# EAGLE design cryptostick-0v2 (EAGLE 6.6.0)

## Sheet 1 of 3: FTDI USB-Conn., FTDI-Chip
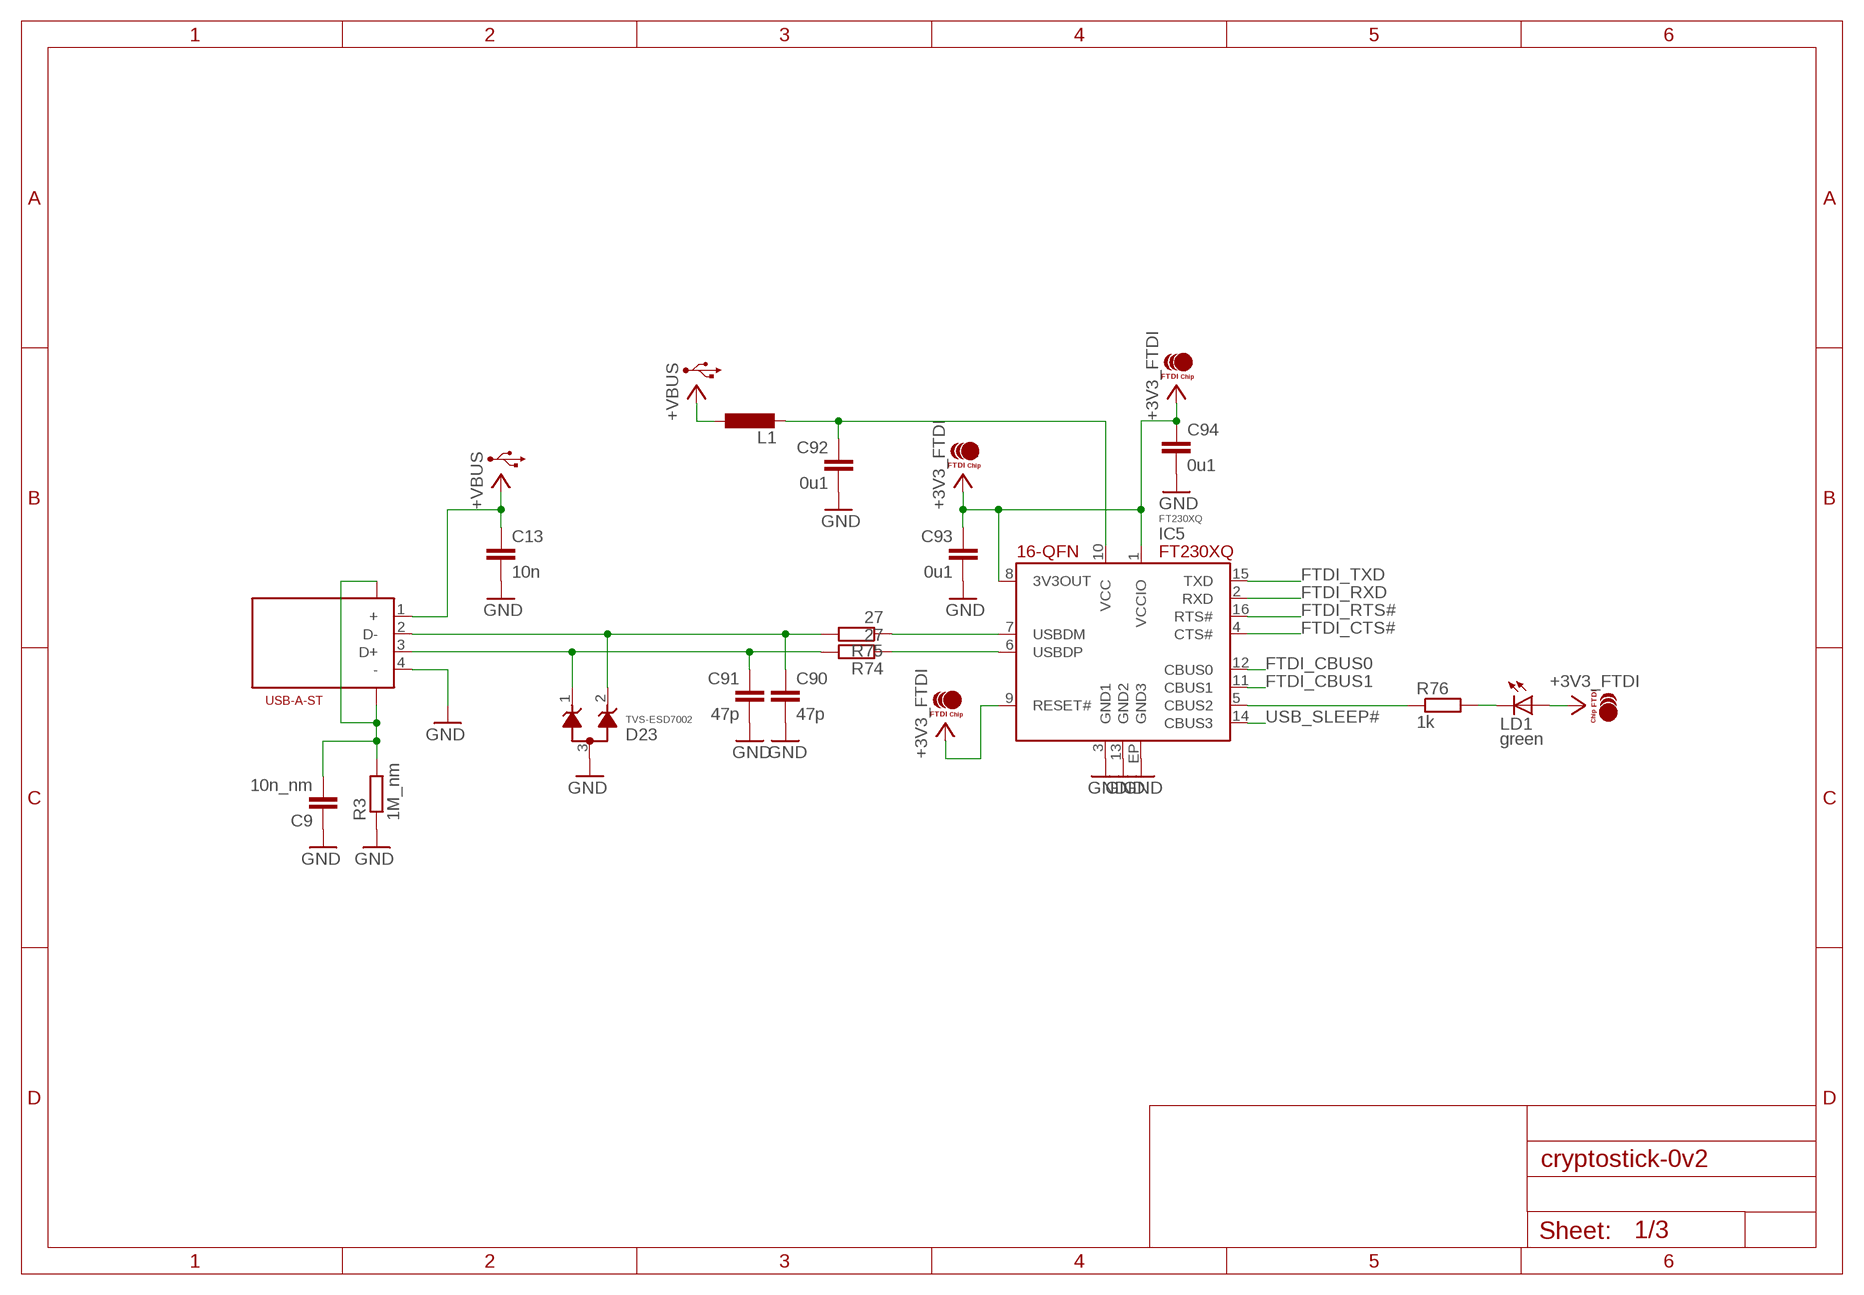
[diagram p0: schematic, sheet 1]

### Parts
C9  10n_nm  C-EUC0603  [C0603]
C13  10n  C-EUR0402-MCU  [R0402-MCU]
C90  47p  C-EUR0402-MCU  [R0402-MCU]
C91  47p  C-EUR0402-MCU  [R0402-MCU]
C92  0u1  C-EUR0402-MCU  [R0402-MCU]
C93  0u1  C-EUR0402-MCU  [R0402-MCU]
C94  0u1  C-EUR0402-MCU  [R0402-MCU]
D23  TVS-ESD7002  [SC70-3]
IC5  FT230XQ  [16QFN-FT230X]
J1  USB-A-ST  [USB-A-ST]
L1  L-EUR0402-MCU  [R0402-MCU]
LD1  green  LED-0603-SIDELED-RPI  [0603-SIDELED-RPI]
R3  1M_nm  R-EU_R0603  [R0603]
R74  27  R-EU_R0402-MCU  [R0402-MCU]
R75  27  R-EU_R0402-MCU  [R0402-MCU]
R76  1k  R-EU_R0402-MCU  [R0402-MCU]

### Nets
+3V3_FTDI: C93.1 C94.1 IC5.1(VCCIO) IC5.8(3V3OUT) IC5.9(RESET#) LD1.A ; also sheet 2,3
+5V_FTDI: C92.1 IC5.10(VCC) L1.2
+VBUS: C13.1 J1.1(+) L1.1 ; also sheet 2,3
FTDI_CBUS0: IC5.12(CBUS0) ; also sheet 2
FTDI_CBUS1: IC5.11(CBUS1) ; also sheet 2
FTDI_CTS#: IC5.4(CTS#) ; also sheet 2
FTDI_RTS#: IC5.16(RTS#) ; also sheet 2
FTDI_RXD: IC5.2(RXD) ; also sheet 2
FTDI_TXD: IC5.15(TXD) ; also sheet 2
FTDI_TXLED#: IC5.5(CBUS2) R76.1
GND: C9.1 C13.2 C90.2 C91.2 C92.2 C93.2 C94.2 D23.3 IC5.3(GND1) IC5.13(GND2) IC5.EP(GND3) J1.4(-) R3.1 ; also sheet 2,3
N$10: LD1.C R76.2
N$39: IC5.7(USBDM) R75.1
N$40: IC5.6(USBDP) R74.1
N$75: C91.1 D23.1 J1.3(D+) R74.2
N$76: C90.1 D23.2 J1.2(D-) R75.2
USB_SHLD: C9.2 J1.SH1 J1.SH2 R3.2
USB_SLEEP#: IC5.14(CBUS3) ; also sheet 2

## Sheet 2 of 3: MCU MSP430 Microcontroller, Crypto-IC
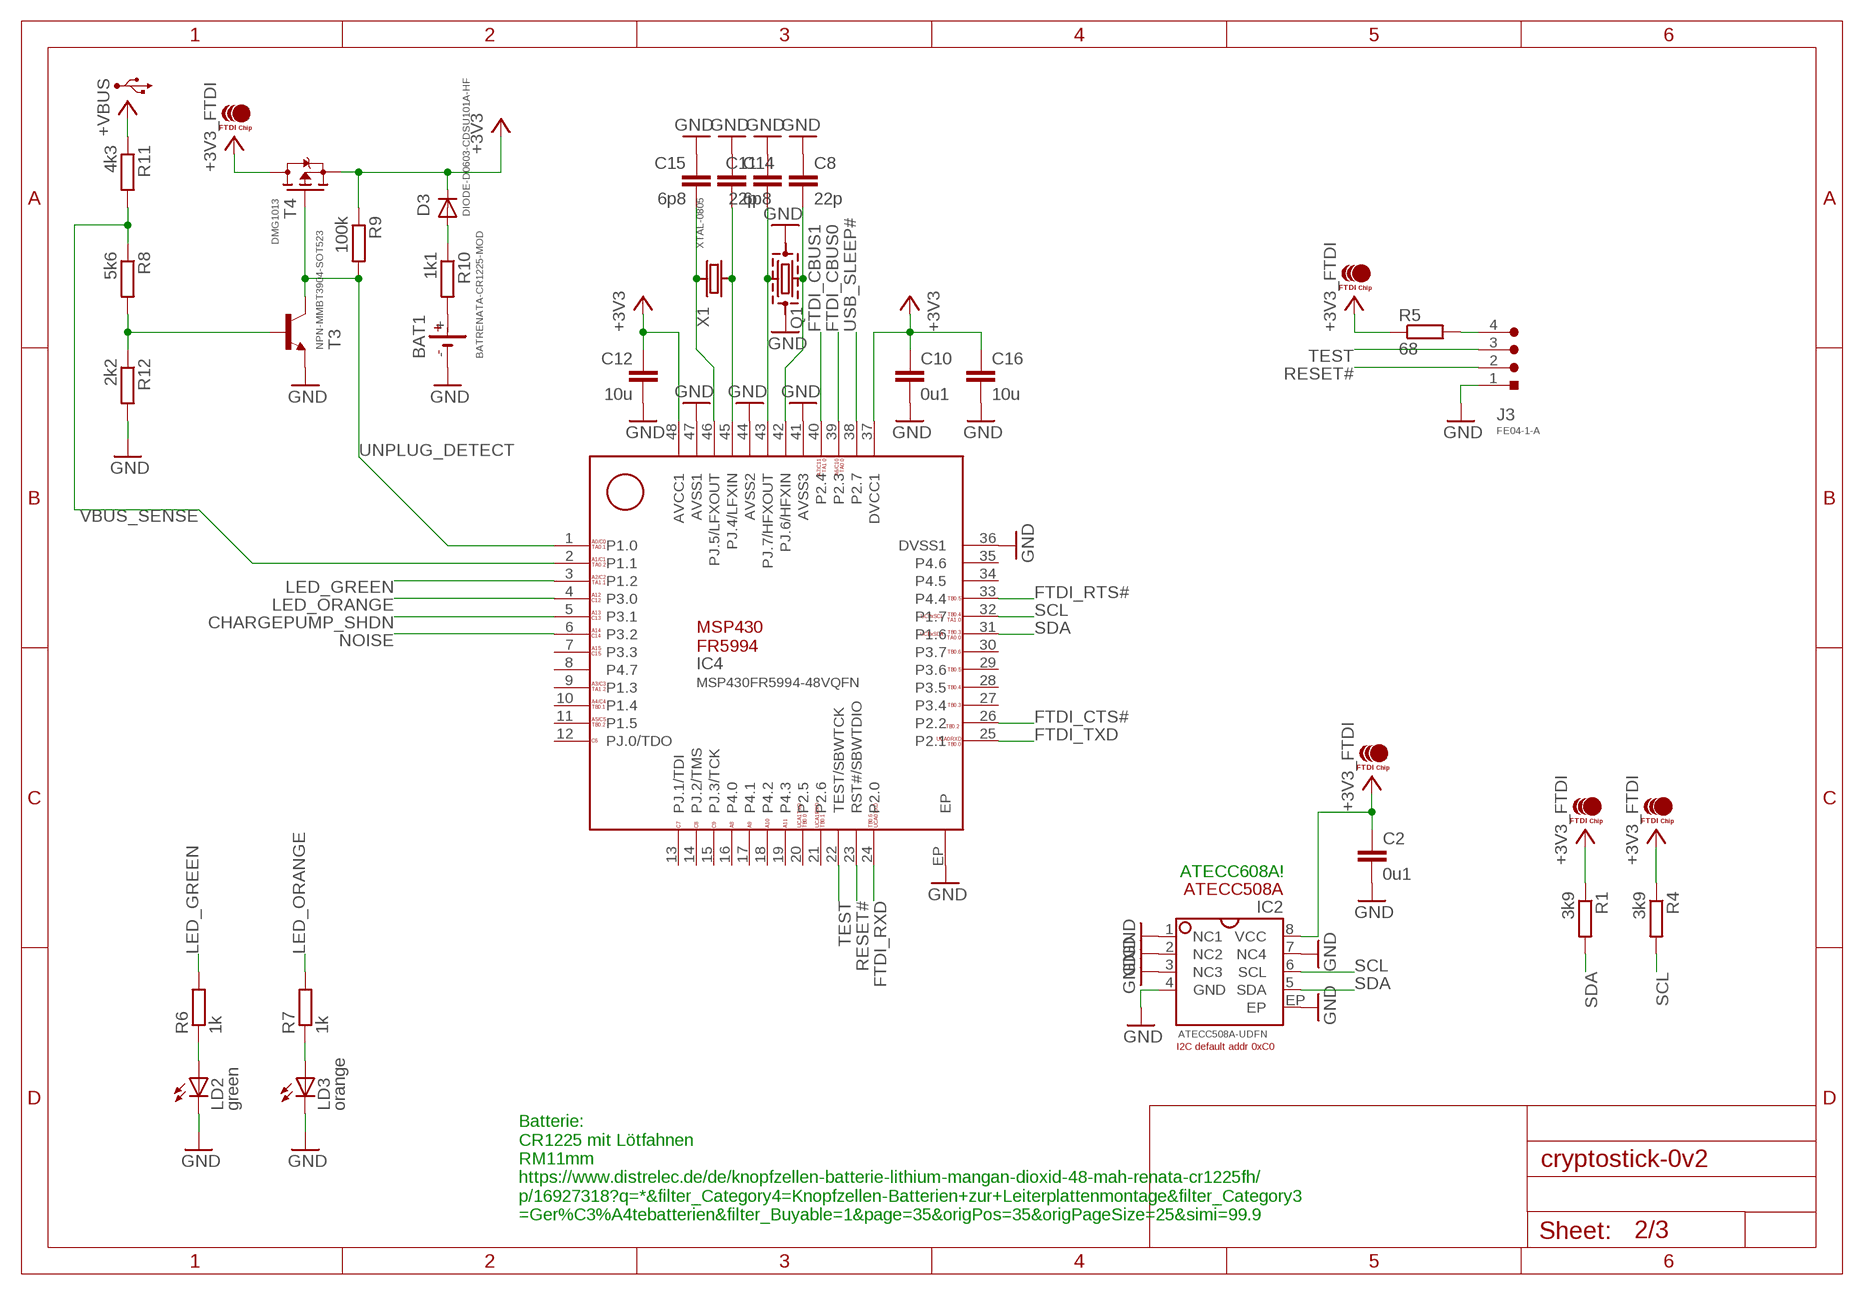
[diagram p1: schematic, sheet 2]

### Parts
BAT1  BATRENATA-CR1225-MOD  [BAT-RENATA-CR1225-MOD]
C2  0u1  C-EUR0402-MCU  [R0402-MCU]
C8  22p  C-EUR0402-MCU  [R0402-MCU]
C10  0u1  C-EUR0402-MCU  [R0402-MCU]
C11  22p  C-EUR0402-MCU  [R0402-MCU]
C12  10u  C-EUR0603-MCU  [R0603-MCU]
C14  6p8  C-EUR0402-MCU  [R0402-MCU]
C15  6p8  C-EUR0402-MCU  [R0402-MCU]
C16  10u  C-EUR0603-MCU  [R0603-MCU]
D3  DIODE-D0603-CDSU101A-HF  DIODE-D0603  [D-D0603]
IC2  ATECC508A-UDFN  [8UDFN]
IC4  MSP430FR5994-48VQFN  [48VQFN-MSP430FR5994]
J3  FE04-1-A  [FE04-1A]
LD2  green  LED-0603-SIDELED-RPI  [0603-SIDELED-RPI]
LD3  orange  LED-0603-SIDELED-RPI  [0603-SIDELED-RPI]
Q1  XTAL-2.0X1.6-MOD  [XTAL-2.0X1.6-MOD]
R1  3k9  R-EU_R0402-MCU  [R0402-MCU]
R4  3k9  R-EU_R0402-MCU  [R0402-MCU]
R5  68  R-EU_R0402-MCU  [R0402-MCU]
R6  1k  R-EU_R0402-MCU  [R0402-MCU]
R7  1k  R-EU_R0402-MCU  [R0402-MCU]
R8  5k6  R-EU_R0402-MCU  [R0402-MCU]
R9  100k  R-EU_R0402-MCU  [R0402-MCU]
R10  1k1  R-EU_R0402-MCU  [R0402-MCU]
R11  4k3  R-EU_R0402-MCU  [R0402-MCU]
R12  2k2  R-EU_R0402-MCU  [R0402-MCU]
T3  NPN-MMBT3904-SOT523  [SOT523]
T4  DMG1013  P-MOSFET-SC70-3  [SC70-3]
X1  XTAL-0805  [XTAL-32KHZ-0805]

### Nets
+3V3: C10.1 C12.1 C16.1 D3.C IC4.37(DVCC1) IC4.48(AVCC1) R9.1 T4.2(S)
+3V3_FTDI: C2.1 IC2.8(VCC) R1.1 R4.1 R5.1 T4.3(D) ; also sheet 1,3
+VBUS: R11.1 ; also sheet 1,3
CHARGEPUMP_SHDN: IC4.5(P3.1) ; also sheet 3
FTDI_CBUS0: IC4.39(P2.3) ; also sheet 1
FTDI_CBUS1: IC4.40(P2.4) ; also sheet 1
FTDI_CTS#: IC4.26(P2.2) ; also sheet 1
FTDI_RTS#: IC4.33(P4.4) ; also sheet 1
FTDI_RXD: IC4.24(P2.0) ; also sheet 1
FTDI_TXD: IC4.25(P2.1) ; also sheet 1
GND: BAT1.- C2.2 C8.1 C10.2 C11.1 C12.2 C14.1 C15.1 C16.2 IC2.1(NC1) IC2.2(NC2) IC2.3(NC3) IC2.4(GND) IC2.7(NC4) IC2.EP IC4.36(DVSS1) IC4.41(AVSS3) IC4.44(AVSS2) IC4.47(AVSS1) IC4.EP J3.1 LD2.C LD3.C Q1.2(GND1) Q1.4(GND2) R12.2 T3.2(E) ; also sheet 1,3
LED_GREEN: IC4.3(P1.2) R6.2
LED_ORANGE: IC4.4(P3.0) R7.2
N$1: J3.4 R5.2
N$3: LD3.A R7.1
N$4: LD2.A R6.1
N$11: C11.2 IC4.43(PJ.7/HFXOUT) Q1.1
N$13: C8.2 IC4.42(PJ.6/HFXIN) Q1.3
N$14: D3.A R10.1
N$16: C14.2 IC4.45(PJ.4/LFXIN) X1.P$1
N$17: BAT1.+ R10.2
N$18: R8.2 R12.1 T3.1(B)
N$19: C15.2 IC4.46(PJ.5/LFXOUT) X1.P$2
NOISE: IC4.6(P3.2) ; also sheet 3
RESET#: IC4.23(RST#/SBWTDIO) J3.2
SCL: IC2.6(SCL) IC4.32(P1.7) R4.2
SDA: IC2.5(SDA) IC4.31(P1.6) R1.2
TEST: IC4.22(TEST/SBWTCK) J3.3
UNPLUG_DETECT: IC4.1(P1.0) R9.2 T3.3(C) T4.1(G)
USB_SLEEP#: IC4.38(P2.7) ; also sheet 1
VBUS_SENSE: IC4.2(P1.1) R8.1 R11.2
Unconnected: IC4.7(P3.3) IC4.8(P4.7) IC4.9(P1.3) IC4.10(P1.4) IC4.11(P1.5) IC4.12(PJ.0/TDO) IC4.13(PJ.1/TDI) IC4.14(PJ.2/TMS) IC4.15(PJ.3/TCK) IC4.16(P4.0) IC4.17(P4.1) IC4.18(P4.2) IC4.19(P4.3) IC4.20(P2.5) IC4.21(P2.6) IC4.27(P3.4) IC4.28(P3.5) IC4.29(P3.6) IC4.30(P3.7) IC4.34(P4.5) IC4.35(P4.6)

### Notes on the sheet
- ATECC608A!
- Batterie:
  CR1225 mit Lötfahnen
  RM11mm
  https://www.distrelec.de/de/knopfzellen-batterie-lithium-mangan-dioxid-48-mah-renata-cr1225fh/
  p/16927318?q=*&filter_Category4=Knopfzellen-Batterien+zur+Leiterplattenmontage&filter_Category3
  =Ger%C3%A4tebatterien&filter_Buyable=1&page=35&origPos=35&origPageSize=25&simi=99.9

## Sheet 3 of 3: TRNG True Random Noise Generator: Noise Diode, Charge Pump
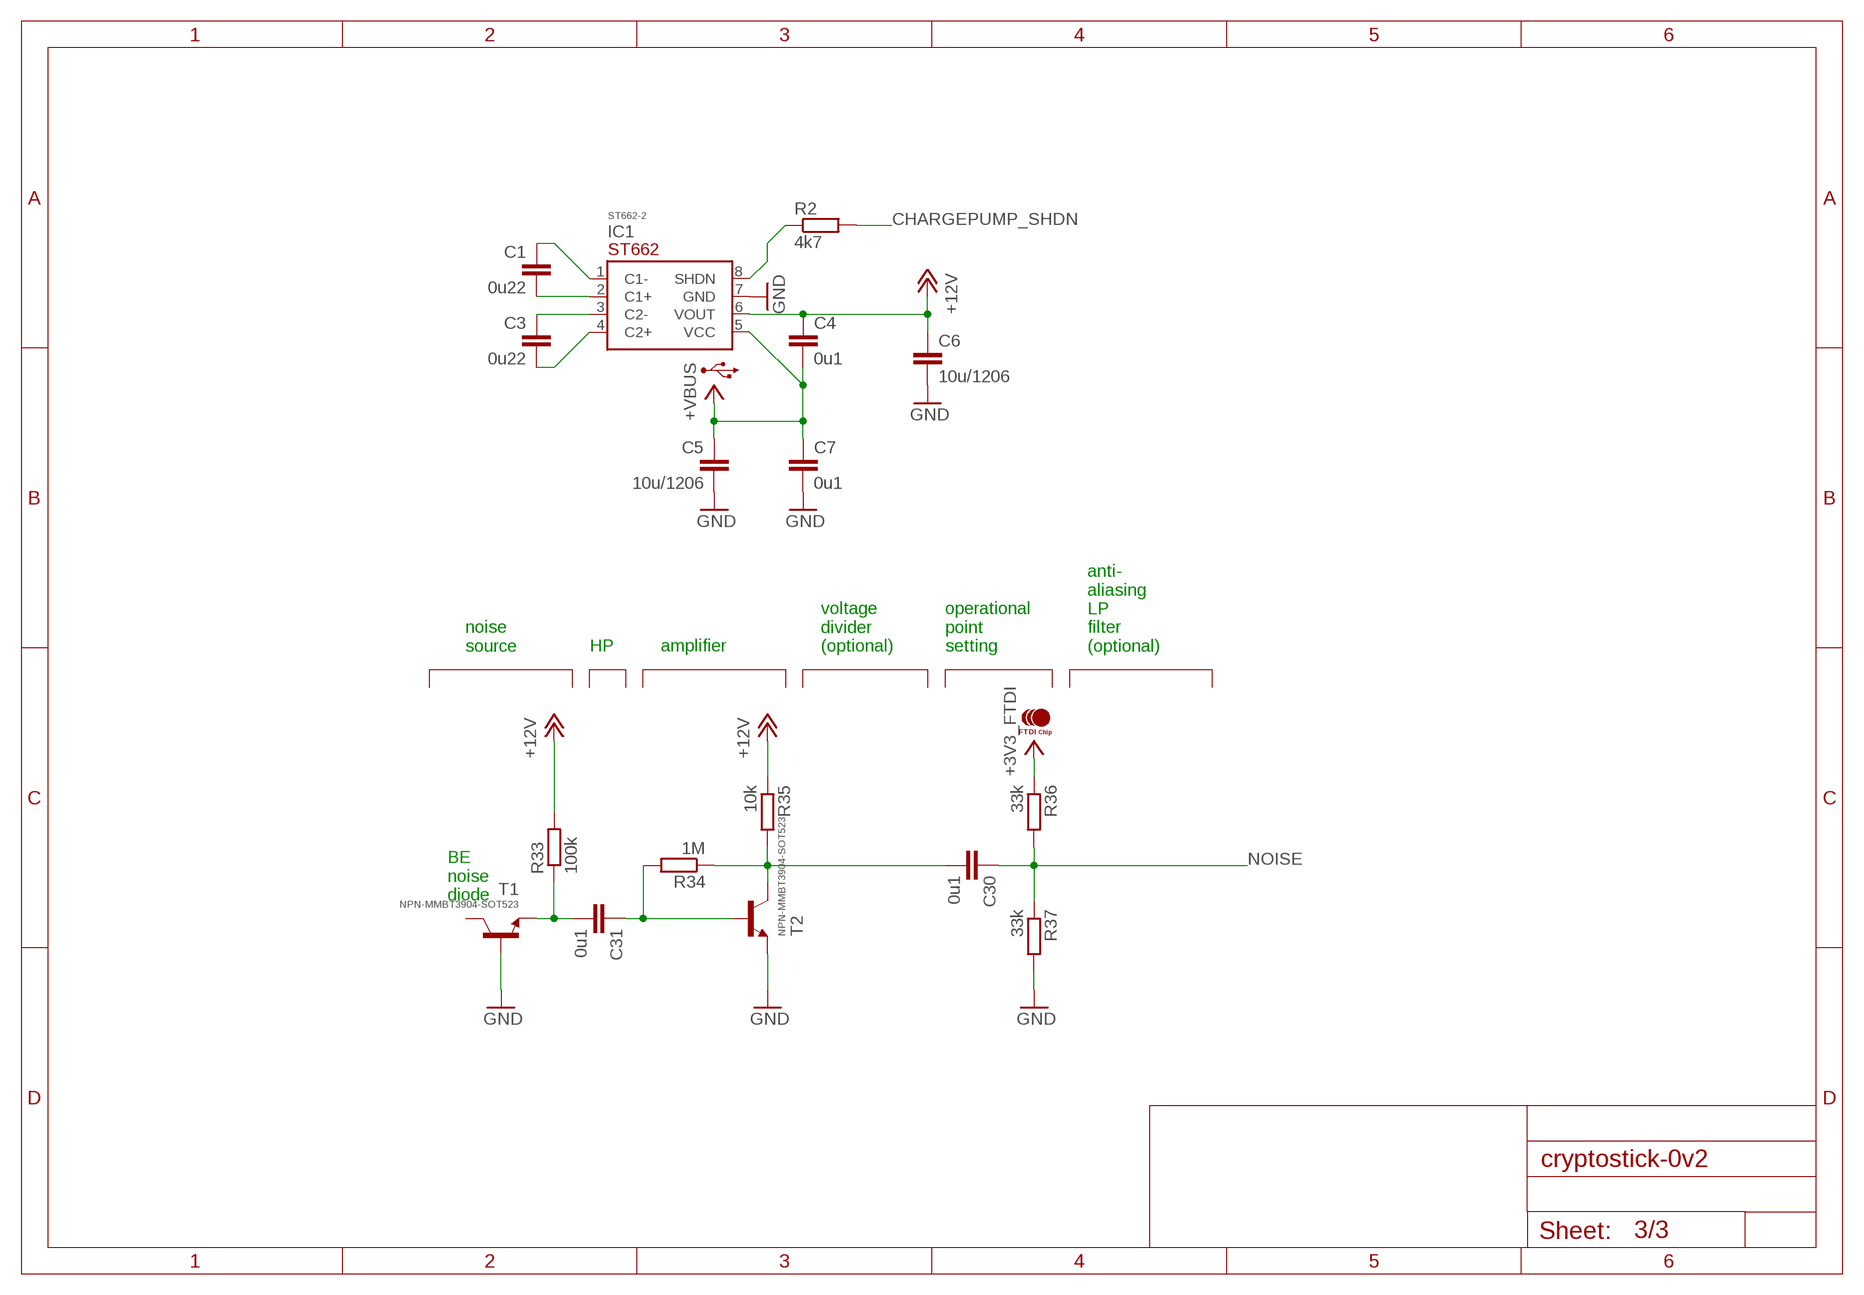
[diagram p2: schematic, sheet 3]

### Parts
C1  0u22  C-EUC0603  [C0603]
C3  0u22  C-EUC0603  [C0603]
C4  0u1  C-EUR0402-MCU  [R0402-MCU]
C5  10u/1206  C-EUC1206  [C1206]
C6  10u/1206  C-EUC1206  [C1206]
C7  0u1  C-EUR0402-MCU  [R0402-MCU]
C30  0u1  C-EUR0402-MCU  [R0402-MCU]
C31  0u1  C-EUR0402-MCU  [R0402-MCU]
IC1  ST662-2  [8SOIC-2]
R2  4k7  R-EU_R0402-MCU  [R0402-MCU]
R33  100k  R-EU_R0402-MCU  [R0402-MCU]
R34  1M  R-EU_R0402-MCU  [R0402-MCU]
R35  10k  R-EU_R0402-MCU  [R0402-MCU]
R36  33k  R-EU_R0402-MCU  [R0402-MCU]
R37  33k  R-EU_R0402-MCU  [R0402-MCU]
T1  NPN-MMBT3904-SOT523  [SOT523]
T2  NPN-MMBT3904-SOT523  [SOT523]

### Nets
+3V3_FTDI: R36.1 ; also sheet 1,2
+12V: C4.1 C6.1 IC1.6(VOUT) R33.2 R35.1
+VBUS: C4.2 C5.1 C7.1 IC1.5(VCC) ; also sheet 1,2
CHARGEPUMP_SHDN: R2.2 ; also sheet 2
GND: C5.2 C6.2 C7.2 IC1.7(GND) R37.2 T1.1(B) T2.2(E) ; also sheet 1,2
N$2: C31.1 R34.2 T2.1(B)
N$5: C30.2 R34.1 R35.2 T2.3(C)
N$6: C3.1 IC1.3(C2-)
N$7: C1.2 IC1.2(C1+)
N$8: C1.1 IC1.1(C1-)
N$9: C3.2 IC1.4(C2+)
N$12: IC1.8(SHDN) R2.1
N$35: C31.2 R33.1 T1.2(E)
NOISE: C30.1 R36.2 R37.1 ; also sheet 2
Unconnected: T1.3(C)

### Notes on the sheet
- noise
  source
- HP | amplifier
- voltage
  divider
  (optional)
- operational
  point
  setting
- anti-
  aliasing
  LP
  filter
  (optional)
- BE
  noise
  diode

## Library data of the parts
BAT1 = cryptostick:BAT
C1-C16 C30 C31 C90-C94 = rcl:C-EU: CAPACITOR, European symbol
D3 = bdsm:DIODE
D23 = hg-box:TVS-ESD7002
IC1 = cryptostick:ST662
IC2 = hg-box:ATECC508A-UDFN
IC4 = cryptostick:MSP430FR5994-48VQFN
IC5 = bdsm:FT230XQ
J1 = cocs:USB-A-ST
J3 = cryptostick:FE04-1
L1 = rcl:L-EU: INDUCTOR, European symbol
LD1-LD3 = led:LED: LED OSRAM: - CHIPLED LG R971, LG N971, LY N971, LG Q971, LY Q971, LO R971, LY R971 LH N974, LH R974 LS Q976, LO Q976, LY Q976 LO Q996 - Hyper CHIPLED LW Q18S LB Q993, LB Q99A, LB R99A - SideLED LS A670, LO A670, LY A670, LG A670, LP A670 LB A673, LV A673, LT A673, LW A673 LH A674 LY A675 LS A676, LA A676, LO A676, LY A676, LW A676 LS A679, LY A679, LG A679 - Hyper Micro SIDELED® LS Y876, LA Y876, LO Y876, LY Y876 LT Y87S - SmartLED LW L88C, LW L88S LB L89C, LB L89S, LG L890 LS L89K, LO L89K, LY L89K LS L896, LA L896, LO L896, LY L896 - TOPLED LS T670, LO T670, LY T670, LG T670, LP T670 LSG T670, LSP T670, LSY T670, LOP T670, LYG T670 LG T671, LOG T671, LSG T671 LB T673, LV T673, LT T673, LW T673 LH T674 LS T676, LA T676, LO T676, LY T676, LB T676, LH T676, LSB T676, LW T676 LB T67C, LV T67C, LT T67C, LS T67K, LO T67K, LY T67K, LW E67C LS E67B, LA E67B, LO E67B, LY E67B, LB E67C, LV E67C, LT E67C LW T67C LS T679, LY T679, LG T679 LS T770, LO T770, LY T770, LG T770, LP T770 LB T773, LV T773, LT T773, LW T773 LH T774 LS E675, LA E675, LY E675, LS T675 LS T776, LA T776, LO T776, LY T776, LB T776 LHGB T686 LT T68C, LB T68C - Hyper Mini TOPLED® LB M676 - Mini TOPLED Santana® LG M470 LS M47K, LO M47K, LY M47K Source: http://www.osram.convergy.de LUXEON: - LUMILED® LXK2-PW12-R00, LXK2-PW12-S00, LXK2-PW14-U00, LXK2-PW14-V00 LXK2-PM12-R00, LXK2-PM12-S00, LXK2-PM14-U00 LXK2-PE12-Q00, LXK2-PE12-R00, LXK2-PE12-S00, LXK2-PE14-T00, LXK2-PE14-U00 LXK2-PB12-K00, LXK2-PB12-L00, LXK2-PB12-M00, LXK2-PB14-N00, LXK2-PB14-P00, LXK2-PB14-Q00 LXK2-PR12-L00, LXK2-PR12-M00, LXK2-PR14-Q00, LXK2-PR14-R00 LXK2-PD12-Q00, LXK2-PD12-R00, LXK2-PD12-S00 LXK2-PH12-R00, LXK2-PH12-S00 LXK2-PL12-P00, LXK2-PL12-Q00, LXK2-PL12-R00 Source: www.luxeon.com KINGBRIGHT: KA-3528ASYC Source: www.kingbright.com
Q1 = cocs:XTAL
R1-R12 R33-R37 R74-R76 = rcl:R-EU_: RESISTOR, European symbol
T1-T3 = bdsm:NPN-MMBT3904
T4 = bdsm:P-MOSFET
X1 = cocs:XTAL-0805

## Board
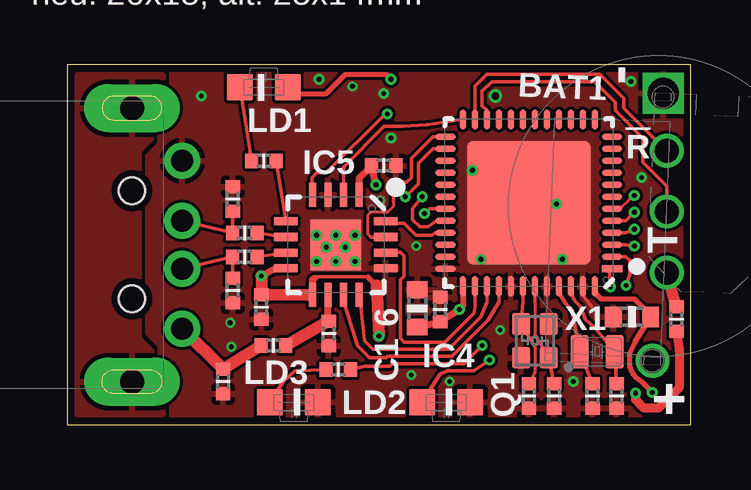
[diagram p3: board, top side]
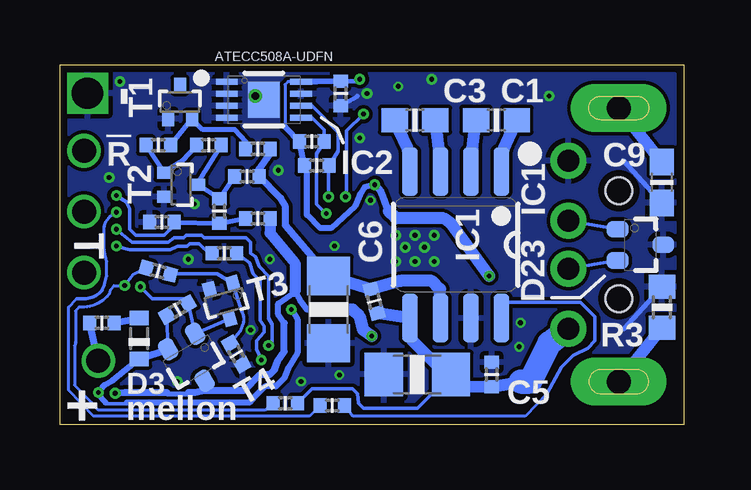
[diagram p4: board, bottom side, seen from below]

Size 26 x 15 mm. Coordinates in mm from the lower left corner, seen from the top.
Outline: 0,0 26,0 26,15 0,15 0,0
Copper layers (1*16): Top 0.035mm / dielectric 1.5mm / Bottom 0.035mm
Design rules "PCB-POOL HighSpec *": minimum track width 0.125mm, minimum drill 0.2mm, track to track 0.125mm, track to pad 0.125mm, pad to pad 0.125mm, via to via 0.125mm, smd to smd 0.125mm, copper to edge 0.3mm, drill to drill 0.2mm, minimum pad ring 0.2mm, minimum via ring 0.1mm, stop-mask expansion 0.075mm, vias tented up to drill 0mil, thermal gap 0.2mm

### Footprints (pad centres in the part's own frame; a part is rotated, then mirrored left to right if it is on the bottom)
BAT-RENATA-CR1225-MOD = drill 1 pad 1.4: + 11.15,0 | drill 1.3 pad 1.7: - 0,0
C0603 = smd 1.1 x 1: 1 -0.85,0; 2 0.85,0
R0402-MCU = smd 0.54 x 0.6: 1 -0.51,0; 2 0.51,0
C1206 = smd 1.6 x 1.8: 1 -1.4,0; 2 1.4,0
R0603-MCU = smd 0.7 x 0.85: 1 -0.775,0; 2 0.775,0
D-D0603 = smd 0.6 x 0.8: A -0.85,0; C 0.85,0
SC70-3 = smd 0.7 x 0.9: 1 -0.65,-0.95; 2 0.65,-0.95; 3 0,0.95
8SOIC-2 = smd 0.66 x 2: 1 -1.905,-3.05; 2 -0.635,-3.05; 3 0.635,-3.05; 4 1.905,-3.05; 5 1.905,3.05; 6 0.635,3.05; 7 -0.635,3.05; 8 -1.905,3.05
8UDFN = smd 0.9 x 0.25: 1 -1.55,0.75; 2 -1.55,0.25; 3 -1.55,-0.25; 4 -1.55,-0.75; 5 1.55,-0.75; 6 1.55,-0.25; 7 1.55,0.25; 8 1.55,0.75 | smd 1.3 x 1.5: EP 0,0
48VQFN-MSP430FR5994 = smd 0.85 x 0.28: 1 -3.475,2.75; 2 -3.475,2.25; 3 -3.475,1.75; 4 -3.475,1.25; 5 -3.475,0.75; 6 -3.475,0.25; 7 -3.475,-0.25; 8 -3.475,-0.75; 9 -3.475,-1.25; 10 -3.475,-1.75; 11 -3.475,-2.25; 12 -3.475,-2.75; 25 3.475,-2.75; 26 3.475,-2.25; 27 3.475,-1.75; 28 3.475,-1.25; 29 3.475,-0.75; 30 3.475,-0.25; 31 3.475,0.25; 32 3.475,0.75; 33 3.475,1.25; 34 3.475,1.75; 35 3.475,2.25; 36 3.475,2.75 | smd 0.28 x 0.85: 13 -2.75,-3.475; 14 -2.25,-3.475; 15 -1.75,-3.475; 16 -1.25,-3.475; 17 -0.75,-3.475; 18 -0.25,-3.475; 19 0.25,-3.475; 20 0.75,-3.475; 21 1.25,-3.475; 22 1.75,-3.475; 23 2.25,-3.475; 24 2.75,-3.475; 37 2.75,3.475; 38 2.25,3.475; 39 1.75,3.475; 40 1.25,3.475; 41 0.75,3.475; 42 0.25,3.475; 43 -0.25,3.475; 44 -0.75,3.475; 45 -1.25,3.475; 46 -1.75,3.475; 47 -2.25,3.475; 48 -2.75,3.475 | smd 5.15 x 5.15: EP 0,0
16QFN-FT230X = smd 1 x 0.325: 1 -2.08,0.975; 2 -2.08,0.325; 3 -2.08,-0.325; 4 -2.08,-0.975; 9 2.08,-0.975; 10 2.08,-0.325; 11 2.08,0.325; 12 2.08,0.975 | smd 0.325 x 1: 5 -0.975,-2.08; 6 -0.325,-2.08; 7 0.325,-2.08; 8 0.975,-2.08; 13 0.975,2.08; 14 0.325,2.08; 15 -0.325,2.08; 16 -0.975,2.08 | smd 2.1 x 2.1: EP 0,0
USB-A-ST = drill 0.92 pad 1.5: 1 3.5,4.8; 2 1,4.8; 3 -1,4.8; 4 -3.5,4.8 | drill 1 pad 2 long: SH1 5.7,2.7; SH2 -5.7,2.7 | hole 1.1: -2.25,2.7; 2.25,2.7
FE04-1A = drill 1.3 pad 1.7 square: 1 -3.66,-0.15 | drill 1 pad 1.4: 2 -1.27,0; 3 1.27,0; 4 3.81,0
0603-SIDELED-RPI = smd 1.1 x 1.1: A -1,0.235; C 1,0.235
XTAL-2.0X1.6-MOD = smd 0.9 x 0.75: 1 -0.7,-0.575; 2 0.7,-0.575; 3 0.7,0.575; 4 -0.7,0.575
R0603 = smd 1 x 1.1: 1 -0.85,0; 2 0.85,0
SOT523 = smd 0.5 x 0.61: 1 -0.5,-0.7; 2 0.5,-0.7; 3 0,0.7
XTAL-32KHZ-0805 = smd 0.75 x 1.4: P$1 -0.725,0; P$2 0.725,0

### Placement (x,y rotation side)
BAT1  24.85,13.81 267.7 top
C1  7.8,12.7 180 bottom
C2  14.3,13.8 270 bottom
C3  11.2,12.7 180 bottom
C4  12.9,5.15 285 bottom
C5  11.1,2.1 180 bottom
C6  14.8,4.8 270 bottom
C7  8,2.1 90 bottom
C8  19.25,1.2 90 top
C9  0.9,10.1 90 bottom
C10  15.55,4.8 90 top
C11  20.3,1.2 90 top
C12  23.55,4.5 180 top
C13  6.5,1.8 270 top
C14  21.9,1.2 90 top
C15  22.9,1.2 90 top
C16  14.6,4.85 90 top
C30  19.35,8.9 90 bottom
C31  21.9,11.65 0 bottom
C90  6.9,5.6 270 top
C91  6.9,9.4 90 top
C92  10.9,3.8 270 top
C93  8.1,4.9 270 top
C94  13.2,10.8 0 top
D3  22.7,3.6 270 bottom
D23  1.8,7.5 270 bottom
IC1  9.5,7.5 180 bottom
IC2  17.5,13.55 0 bottom
IC4  19.25,9.25 180 top
IC5  11.2,7.5 270 top
J1  0,7.5 270 top
J3  25,10.15 270 top
L1  8.6,3.3 0 top
LD1  8.2,14.3 180 top
LD2  15.8,0.7 0 top
LD3  9.45,0.7 0 top
Q1  19.5,3.5 90 top
R1  15.5,11.8 0 bottom
R2  14.65,0.8 180 bottom
R3  0.9,4.9 270 bottom
R4  15.3,10.8 0 bottom
R5  25.4,4.4 90 top
R6  19.15,7.15 180 bottom
R7  11.3,2.3 0 top
R8  21.9,6.4 345 bottom
R9  21.1,4.8 30 bottom
R10  24.25,4.25 180 bottom
R11  16.6,0.9 180 bottom
R12  18.65,2.95 300 bottom
R33  17.75,11.5 0 bottom
R34  19.8,11.65 180 bottom
R35  18.2,10.35 180 bottom
R36  17.75,8.6 180 bottom
R37  21.75,8.45 180 bottom
R74  7.4,8 180 top
R75  7.4,7 180 top
R76  8.2,11 180 top
T1  21,13.45 0 bottom
T2  20.95,10 270 bottom
T3  19.1,5.1 195 bottom
T4  20.45,2.65 210 bottom
X1  22.1,3.05 0 top

### Tracks (layer width: path | path; a pad name or v marks a point on that pad's centre or on a via)
+3V3  (via drill 0.2 pad 0.45)
  Top 0.2: 22,5.5 22.25,5.25 23.65,5.25 24.15,4.75 C12.1 | v24.4,1.35 23.95,1.8 arc-60 23.45,2.6 23.45,3 23.7,3.5
  Top 0.25: IC4.37 16.5,4.95 v16.35,4.8 | IC4.48 22,5.5 | 23.7,3.5 C12.1
  Top 0.3: C16.1 C10.1 v16.35,4.8
  Bottom 0.15: 23.2,0.93 23.2,0.88 24.05,0.88 24.1,0.93 | R9.1 T4.2
  Bottom 0.25: v16.35,4.8 16.1,4.4 16.1,3 16.5,2.35 16.65,1.95 17,1.6 17.45,1.6 17.9,1.15 18.1,0.93 23.2,0.93 | 24.1,0.93 24.4,1.25 v24.4,1.35 24.15,1.65 23.8,1.85 D3.C
  Bottom 0.3: D3.C T4.2
+3V3_FTDI  (via drill 0.2 pad 0.45)
  Top 0.15: 10.3,6.1 10.38,6.17 12.53,6.17 12.55,6.15
  Top 0.2: LD1.A 9.5,13.8 10.8,13.8 11.6,14.6 13.3,14.6 v13.5,14.4 | 12.55,6.15 12.9,5.8
  Top 0.3: IC5.8 8.71,6.53 v8.1,6.2 | 10.1,5.4 IC5.9 10.22,6.03 10.3,6.1 | IC5.1 12.18,10.28 12.6,10.7 C94.1 v12.88,10
  Top 0.375: R5.1 25.51,3.1 25.51,1.55 24.65,0.7 24.05,0.7 23.7,1.05 v23.7,1.31
  Top 0.5: v8.1,6.2 C93.1 10.1,5.4 | 12.9,5.8 v13,3.7
  Bottom 0.125: IC2.8 16.5,14.3 16.62,14.18 16.62,12.43 16.6,12.4
  Bottom 0.2: v13.5,14.4 13.6,14.3 C2.1 | 21.55,1.35 21.55,1.3 20.65,1.3 20.65,1.35
  Bottom 0.25: C2.1 15.3,14.3 IC2.8 | v12.88,10 13.3,9.9 13.5,9.6 13.7,9.1 14.7,8.2 15.15,8.2 15.7,8.75 15.7,10.6 R4.1 R1.1 16.6,12.4 | 15.45,4.8 15.7,4.8 16,5.2 16.2,5.55 16.9,5.05 16.9,4.6 16.65,4.25
  Bottom 0.3: 12.3,8.9 12.6,9.7 v12.88,10 | v23.7,1.31 23.3,1.35 21.55,1.35 | 20.65,1.35 20.35,1.35 20,1.45 | 20,1.45 18.3,1.45 17.65,2.1 17.25,2.1 17.05,2.3 16.9,2.7 16.65,3.05 16.65,4.25 | T4.3 20,1.45
  Bottom 0.45: R36.1 17.25,8.45 17.25,8 16.2,6.75 16.2,5.55
  Bottom 0.5: v8.1,6.2 9.7,8.4 10,8.6 12,8.6 12.3,8.9 | v13,3.7 13.35,3.95 13.5,4.5 13.8,4.8 15.45,4.8
+5V_FTDI
  Top 0.3: C92.1 10.88,4.6 IC5.10
  Top 0.5: L1.2 C92.1
+12V
  Bottom 0.3: C6.1 16.6,8.3 16.6,9.1 16.8,9.45 R35.1 17.7,10.5 17.7,10.65 17.25,11.3 17.25,11.35 R33.2
  Bottom 0.5: IC1.6 10.15,5.65 10.5,6 11.8,6 C4.1 C6.1
+VBUS
  Top 0.5: J1.1 C13.1 L1.1
  Bottom 0.15: C5.1 11.1,0.7 13.35,0.7 13.55,0.9 13.6,1.3 13.8,1.5 15.5,1.5 R11.1
  Bottom 0.5: C4.2 IC1.5 11.3,3.5 10.4,2.6 C5.1 9.5,1.6 C7.1 6.8,1.8
  Bottom 1: 6.8,1.8 6.4,1.8 5.6,3.4 J1.1
CHARGEPUMP_SHDN  (via drill 0.2 pad 0.45)
  Top 0.15: v23.65,8.85 23.3,8.5 IC4.5
  Bottom 0.125: R2.2 15.6,0.36 24.6,0.36 25.64,1.45 25.64,4.9 25.3,5.25 | 24.25,5.6 24.15,5.8 24.05,6.2 24.05,6.8 24.15,7.3 24.15,8.25 24.1,8.45 23.9,8.7 v23.65,8.85
  Bottom 0.15: 25.3,5.25 25,5.25 arc-50 24.25,5.6
FTDI_CBUS0
  Top 0.15: IC5.12 12.25,4.85 12.4,3.5 12.75,3.15 15.9,3.15 17.25,4.5 17.5,5.1 IC4.39
FTDI_CBUS1
  Top 0.15: IC5.11 11.6,4.9 12.1,3.3 12.6,2.8 13.3,2.8 13.35,2.85 16.05,2.85 17.55,4.35 18,5.1 IC4.40
FTDI_CTS#  (via drill 0.2 pad 0.45)
  Top 0.15: IC5.4 10.2,10.3 10.4,10.5 10.8,10.5 13.25,12.95 v13.35,12.95 | v14.1,9.5 14.65,10.05 14.65,10.9 15.25,11.5 IC4.26
  Bottom 0.15: v13.35,12.95 14.05,12.25 14.05,9.8 v14.1,9.5
FTDI_RTS#
  Top 0.15: IC5.16 13.5,8.4 14.05,8.4 14.55,7.9 15.2,7.9 15.35,8 IC4.33
FTDI_RXD
  Top 0.15: IC5.2 11.53,10.72 13.2,12.45 14,12.45 15,12.5 IC4.24
FTDI_TXD
  Top 0.125: 13.6,9.3 13.6,9.1 13.35,8.85 12.65,8.85 12.53,8.72 12.53,7.97 12.68,7.83
  Top 0.15: 13.6,9.3 13.6,9.75 13.95,10.1 14.15,10.1 14.35,10.3 14.35,11.1 15.25,12 IC4.25 | 12.68,7.83 IC5.15
FTDI_TXLED#
  Top 0.15: R76.1 IC5.5
GND  (via drill 0.2 pad 0.4, 0.2 pad 0.45, 0.3 pad 0.55)
  Top 0.15: IC4.47 21.5,5.4 21.85,4.95
  Bottom 0.2: R3.1 2.5,4 | C9.1 2.5,11 | C2.2 13.6,13.7
  other vias: 23.5,14.3 5.6,13.7 10.5,14.4 16.9,10.6 13.5,11.95 17.85,13.7 11.2,6.8 13.05,9.35 13.2,13.8 11.9,14.1 21.1,1.8 23.95,10.3 6.85,3.25 17.25,6.9 14.55,7.45 15.95,1.8 14.35,2.08 18.05,3.95 6.8,4.25 20.65,6.9 10.4,7.9 10.4,6.8 12,6.8 12,7.9 20.4,9.2 11.2,7.9 10.8,7.4 11.6,7.4
  pour Top (isolate 0.125, rank 2): 25.62,14.62 25.62,0.38 0.38,0.38 0.38,14.62
  pour Bottom (isolate 0.15): 25.62,14.62 25.62,0.38 0.38,0.38 0.38,14.62
LED_GREEN  (via drill 0.2 pad 0.45)
  Top 0.15: v23.65,7.45 23.3,7.5 IC4.3
  Bottom 0.15: R6.2 19.75,7.1 20.2,7.55 20.6,7.55 20.7,7.45 21.1,7.45 21.4,7.3 23.1,7.3 v23.65,7.45
LED_ORANGE  (via drill 0.2 pad 0.45)
  Top 0.15: R7.2 12.4,2.45 13.45,2.45 13.55,2.55 16.55,2.55 v17.3,3.3 | IC4.4 23.3,8 v23.65,8.15
  Bottom 0.15: v17.3,3.3 17.15,3.35 17.15,4.2 17.3,4.45 17.3,6.2 17.7,6.6 17.85,7 18.05,7.15 18.05,7.6 18.25,7.8 20,7.8 20.1,7.9 20.75,7.9 20.85,7.8 21.25,7.8 21.5,7.6 23,7.6 23.4,7.95 v23.65,8.15
N$1
  Top 0.45: R5.2 J3.4
N$2
  Bottom 0.2: C31.1 T2.1 21.5,10.65 20.9,11 R34.2
N$3
  Top 0.15: LD3.A 9,1.8 9.5,2.25 R7.1
N$4  (via drill 0.2 pad 0.45)
  Top 0.15: LD2.A 15.55,2.1 15.85,2.25 16.95,2.25 v17.6,2.7
  Bottom 0.15: v17.6,2.7 17.8,3.15 17.8,3.5 17.5,3.85 17.5,4.1 17.65,4.35 17.65,6 17.95,6.3 18.1,6.75 R6.1
N$5
  Bottom 0.2: R34.1 19.96,10.54 20.2,10.15 T2.3 C30.2 R35.2
N$6
  Bottom 0.5: IC1.3 10.2,11.5 C3.1
N$7
  Bottom 0.5: IC1.2 8.8,11.5 C1.2
N$8
  Bottom 0.5: IC1.1 7.5,11.5 C1.1
N$9
  Bottom 0.5: IC1.4 11.5,11.5 C3.2
N$10
  Top 0.15: LD1.C R76.2
N$11
  Top 0.125: 19.5,5.1 19.5,3.75 Q1.1
  Top 0.15: C11.2 Q1.1 | IC4.43 19.5,5.1
N$12
  Bottom 0.125: 5.7,1.3 6.6,0.36 13.8,0.36 14.1,0.75
  Bottom 0.15: IC1.8 7.5,5.1 4.3,5.1 3.7,4.5 3.7,3.5 4,3.2 4.6,2.9 5.1,2.4 5.7,1.3 | 14.1,0.75 R2.1
N$13
  Top 0.125: Q1.3 19.5,3.25 19.5,2.2 C8.2
  Top 0.15: IC4.42 19,5.1 Q1.3
N$14
  Bottom 0.3: R10.1 D3.A
N$16
  Top 0.15: IC4.45 20.55,5.45 20.8,5.05 21.05,4.8 X1.P$1 C14.2
N$17
  Bottom 0.3: BAT1.+ R10.2
N$18
  Bottom 0.125: 18.4,4.7 18.35,4.5 18.35,4.3 18.5,3.9
  Bottom 0.15: R8.2 21.2,6.3 19.45,6.3 T3.1 18.4,4.7 | 18.5,3.9 R12.1
N$19
  Top 0.15: IC4.46 21.05,5.45 21.15,5.2 21.4,4.95 21.6,4.4 22,4.05 X1.P$2 C15.2
N$35
  Bottom 0.2: C31.2 T1.2 20.05,12.3 18.7,12.3 18.25,11.8 R33.1
N$39
  Top 0.15: R75.1 IC5.7
N$40
  Top 0.15: IC5.6 R74.1
N$75
  Top 0.15: C91.1 R74.2 J1.3
  Bottom 0.15: D23.1 J1.3
N$76
  Top 0.15: C90.1 R75.2 J1.2
  Bottom 0.15: D23.2 J1.2
NOISE  (via drill 0.2 pad 0.45)
  Top 0.125: 23.05,9 23.45,9.4 v23.65,9.55
  Top 0.15: IC4.6 23.05,9
  Bottom 0.15: 21.25,8.3 21.65,7.9 22.85,7.9 23.1,8.15 23.1,9 23.25,9.3 v23.65,9.55
  Bottom 0.2: R36.2 C30.1 R37.1 21.25,8.3
RESET#
  Top 0.15: J3.2 24.3,12.1 23.2,13.2 23.2,13.6 22.2,14.6 17.5,14.6 17,14.1 IC4.23
SCL  (via drill 0.2 pad 0.45)
  Top 0.15: v14.8,9.5 14.4,9 14.4,8.55 14.7,8.25 15.05,8.25 15.4,8.5 IC4.32
  Bottom 0.15: IC2.6 15.5,13.3 14.4,12.2 14.4,11.4 R4.2 14.8,10.6 v14.8,9.5
SDA  (via drill 0.2 pad 0.45)
  Top 0.15: IC4.31 15.1,9 v14.9,8.8
  Bottom 0.15: IC2.5 15.5,12.8 15,12.3 R1.2 15.3,11.3 15.3,9.2 v14.9,8.8
TEST
  Top 0.15: J3.3 25,9.95 24,10.95 24,11.95 22.85,13.1 22.85,13.45 22,14.3 17.7,14.3 17.3,13.9 17.3,13.3 17.5,13.1 IC4.22
UNPLUG_DETECT  (via drill 0.2 pad 0.45)
  Top 0.15: v22.65,5.75 22.6,6.5 IC4.1
  Bottom 0.15: v22.65,5.75 22.15,5.25 20.7,5.25 R9.2 T4.1 T3.3
USB_SHLD
  Bottom 0.5: C9.2 J1.SH2 | R3.2 J1.SH1
  pour Top (isolate 0.2): 0.4,14.6 4,14.6 4,12.4 3,11.4 3,3.6 4,2.6 4,0.4 0.4,0.4
USB_SLEEP#
  Top 0.15: IC5.14 13.5,7.2 13.9,7.2 14.05,7.05 14.05,6.2 13.9,6.05 13.9,3.6 14.05,3.45 15.75,3.45 16.95,4.65 17,4.9 IC4.38
VBUS_SENSE  (via drill 0.2 pad 0.45)
  Top 0.15: v23.3,5.8 23.45,6.25 23.45,6.85 23.3,7 IC4.2
  Bottom 0.125: R11.2 17.45,0.61 24.4,0.61 24.7,0.95 25.39,1.65 25.39,3.3 25.35,3.45 25.35,4.75 25.2,4.9 25,4.9 arc-50 23.95,5.45 23.9,5.6 23.75,5.8 v23.3,5.8 22.95,6.25 R8.1

### Text on the board
tPlace: https://www.digikey.de/short/j279b2 | neu: 26x15, alt: 25x14mm | - | !R | T | +
bPlace: - | !R | T | mellon | +
tNames: 6 | C1